# EAGLE design 6DOF-Digital-v10 (EAGLE 5.10)
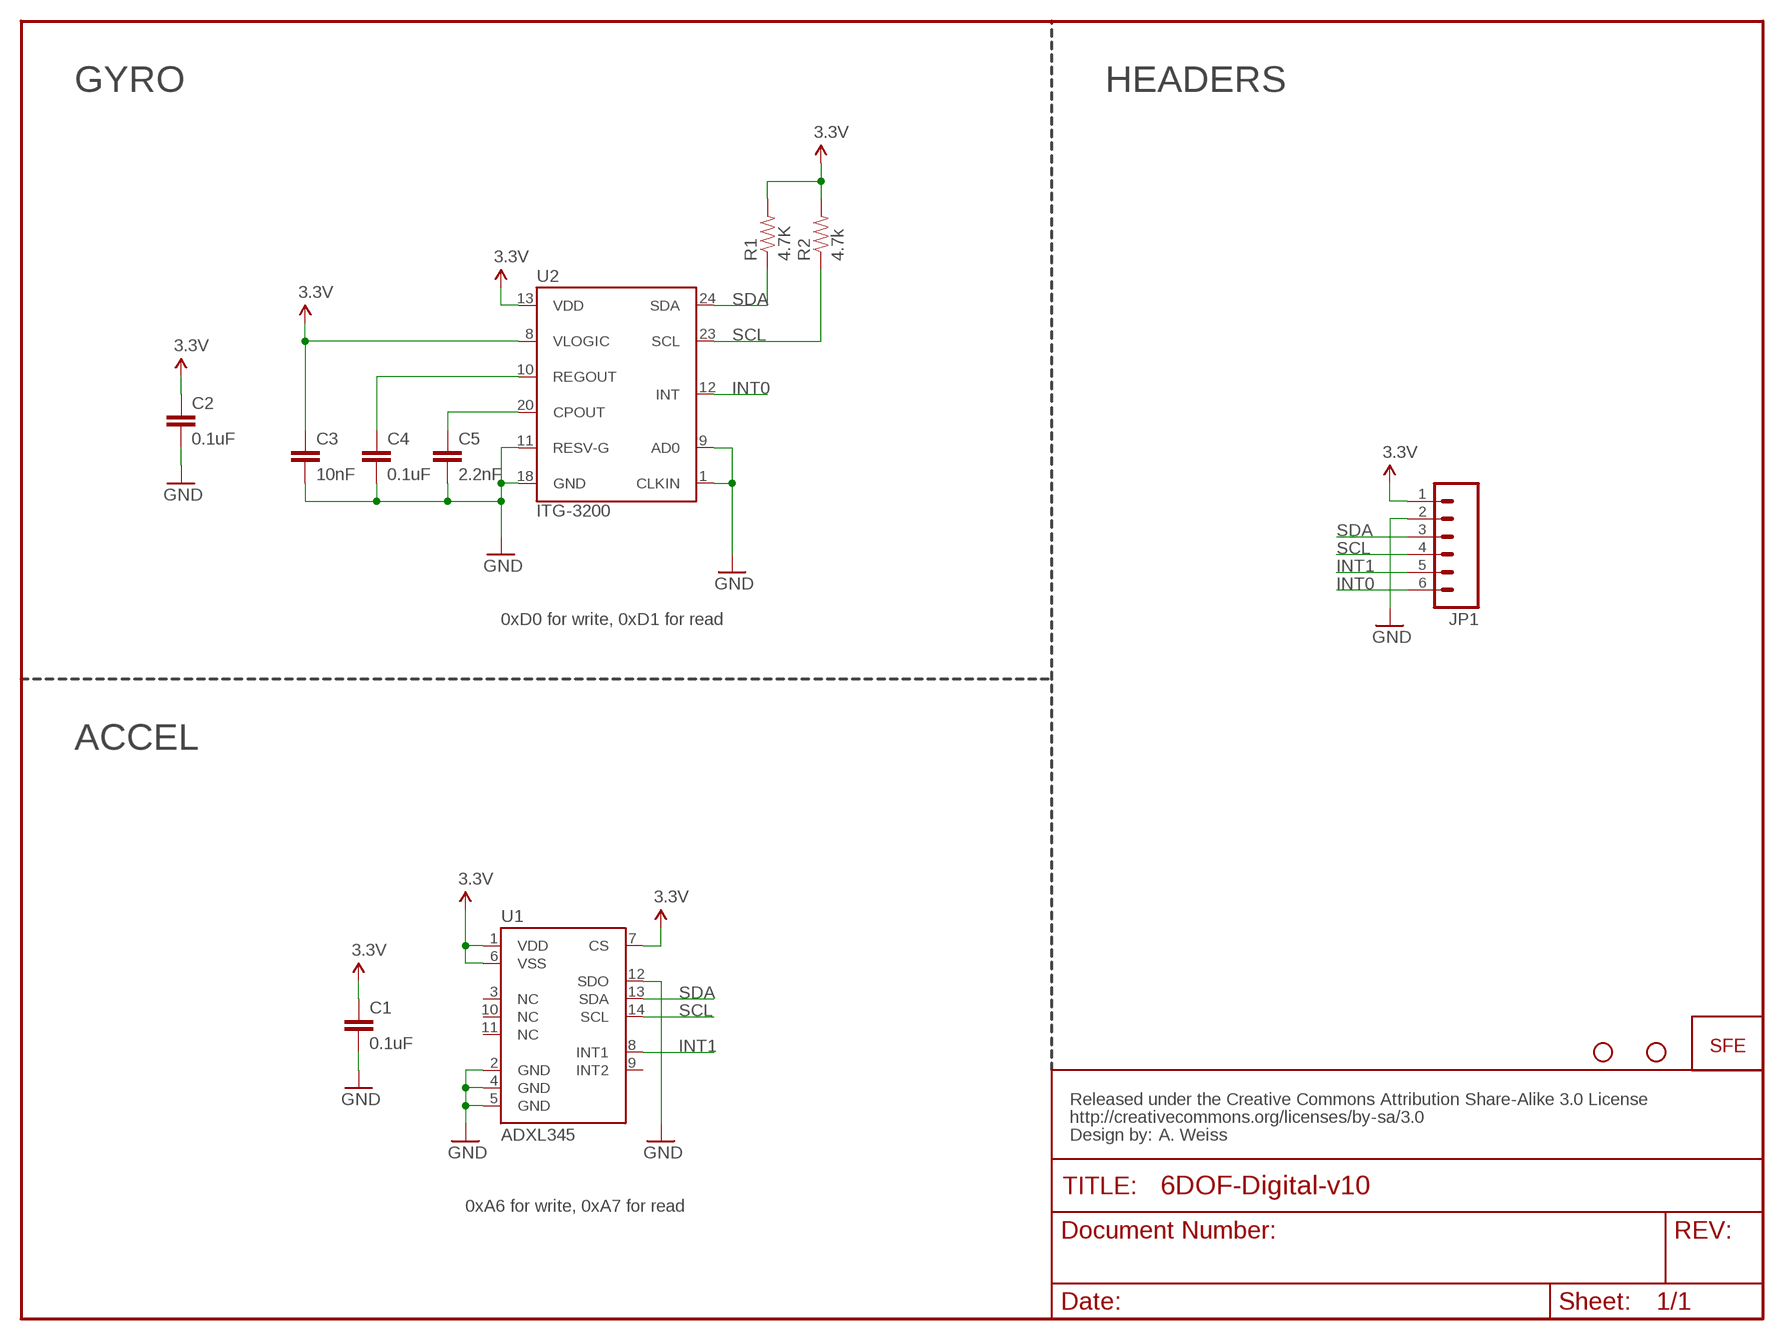
[diagram p0: schematic, sheet 1]

## Parts
C1  0.1uF  CAP0402-CAP  [0402-CAP]
C2  0.1uF  CAP0402-CAP  [0402-CAP]
C3  10nF  CAP0402-CAP  [0402-CAP]
C4  0.1uF  CAP0402-CAP  [0402-CAP]
C5  2.2nF  CAP0402-CAP  [0402-CAP]
JP1  M06SIP  [1X06]
JP2  STAND-OFF  [STAND-OFF]
JP3  LOGO-SFESK  [SFE-LOGO-FLAME]
JP5  STAND-OFF  [STAND-OFF]
R1  4.7K  RESISTOR0402-RES  [0402-RES]
R2  4.7k  RESISTOR0402-RES  [0402-RES]
U1  ADXL345  [LGA14]
U2  ITG-3200  [QFN-24]
U$1  CREATIVE_COMMONS  [CREATIVE_COMMONS]

## Nets
3.3V: C1.1 C2.1 C3.1 JP1.1 R1.2 R2.2 U1.1(VDD) U1.6(VSS) U1.7(CS) U2.8(VLOGIC) U2.13(VDD)
GND: C1.2 C2.2 C3.2 C4.2 C5.2 JP1.2 U1.2(GND) U1.4(GND) U1.5(GND) U1.12(SDO) U2.1(CLKIN) U2.9(AD0) U2.11(RESV-G) U2.18(GND)
INT0: JP1.6 U2.12(INT)
INT1: JP1.5 U1.8(INT1)
N$2: C5.1 U2.20(CPOUT)
N$3: C4.1 U2.10(REGOUT)
SCL: JP1.4 R2.1 U1.14(SCL) U2.23(SCL)
SDA: JP1.3 R1.1 U1.13(SDA) U2.24(SDA)
Unconnected: U1.3(NC) U1.9(INT2) U1.10(NC) U1.11(NC)

## Notes on the sheet
- GYRO | HEADERS
- 0xD0 for write, 0xD1 for read
- ACCEL
- A. Weiss
- 0xA6 for write, 0xA7 for read

## Library data of the parts
C1-C5 = SparkFun:CAP: Capacitor Standard 0603 ceramic capacitor, and 0.1" leaded capacitor.
JP1 = SparkFun:M06: Header 6 Standard 6-pin 0.1" header. Use with straight break away headers (SKU : PRT-00116), right angle break away headers (PRT-00553), swiss pins (PRT-00743), machine pins (PRT-00117), and female headers (PRT-00115). Molex polarized connector foot print use with SKU : PRT-08094 with associated crimp pins and housings. NOTES ON THE VARIANTS LOCK and LOCK_LONGPADS... This footprint was designed to help hold the alignment of a through-hole component (i.e. 6-pin header) while soldering it into place. You may notice that each hole has been shifted either up or down by 0.005 of an inch from it's more standard position (which is a perfectly straight line). This slight alteration caused the pins (the squares in the middle) to touch the edges of the holes. Because they are alternating, it causes a "brace" to hold the component in place. 0.005 has proven to be the perfect amount of "off-center" position when using our standard breakaway headers. Although looks a little odd when you look at the bare footprint, once you have a header in there, the alteration is very hard to notice. Also, if you push a header all the way into place, it is covered up entirely on the bottom side. This idea of altering the position of holes to aid alignment will be further integrated into the Sparkfun Library for other footprints. It can help hold any component with 3 or more connection pins.
JP2 JP5 = SparkFun:STAND-OFF: Stand Off This is the mechanical footprint for a #4 phillips button head screw. Use the keepout ring to avoid running the screw head into surrounding components. SKU : PRT-00447
JP3 = SparkFun:LOGO-SFE: Spark Fun Electronics PCB Logo This is the standard Spark Fun Electronics PCB logo.
R1 R2 = SparkFun:RESISTOR: Resistor Basic schematic elements and footprints for 0603, 1206, and PTH resistors.
U1 = SparkFun:ADXL345
U2 = SparkFun:ITG-3200: ITG-3200 3-axis gyro, digital output, qfn24 package
U$1 = SparkFun:CREATIVE_COMMONS

## Board
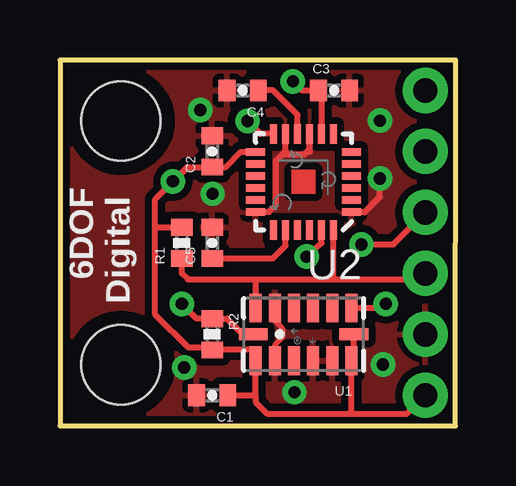
[diagram p1: board, top side]
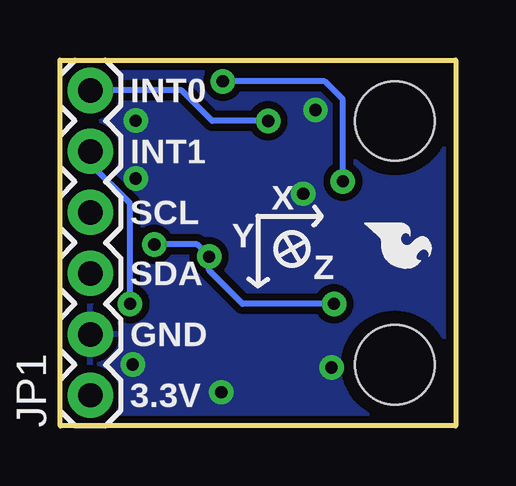
[diagram p2: board, bottom side, seen from below]

Size 16.51 x 15.24 mm. Coordinates in mm from the lower left corner, seen from the top.
Outline: 0,0 16.49,0 16.51,15.24 0,15.24 0,0
Copper layers (1*16): Top 0.035mm / dielectric 1.5mm / Bottom 0.035mm
Design rules "SparkFun": minimum track width 8mil, minimum drill 20mil, track to track 8mil, track to pad 8mil, pad to pad 8mil, via to via 8mil, smd to smd 8mil, copper to edge 8mil, drill to drill 8mil, minimum pad ring 12mil, minimum via ring 10mil, stop-mask expansion 4mil, vias tented up to drill 20mil, thermal gap 10mil

### Footprints (pad centres in the part's own frame; a part is rotated, then mirrored left to right if it is on the bottom)
0402-CAP = smd 0.7 x 0.9: 1 -0.65,0; 2 0.65,0
1X06 = drill 1.016 pad 1.88 round: 1 0,0; 2 2.54,0; 3 5.08,0; 4 7.62,0; 5 10.16,0; 6 12.7,0
STAND-OFF = hole 3.302: 0,0
0402-RES = smd 0.7 x 0.9: 1 -0.65,0; 2 0.65,0
LGA14 = smd 0.5 x 1.2: 1 2,1.1; 2 1.2,1.1; 3 0.4,1.1; 4 -0.4,1.1; 5 -1.2,1.1; 6 -2,1.1; 8 -2,-1.1; 9 -1.2,-1.1; 10 -0.4,-1.1; 11 0.4,-1.1; 12 1.2,-1.1; 13 2,-1.1 | smd 1.2 x 0.5: 7 -2.1,0; 14 2.1,0
QFN-24 = smd 0.8 x 0.3: 1 -2,1.25; 2 -2,0.75; 3 -2,0.25; 4 -2,-0.25; 5 -2,-0.75; 6 -2,-1.25; 13 2,-1.25; 14 2,-0.75; 15 2,-0.25; 16 2,0.25; 17 2,0.75; 18 2,1.25 | smd 0.3 x 0.8: 7 -1.25,-2; 8 -0.75,-2; 9 -0.25,-2; 10 0.25,-2; 11 0.75,-2; 12 1.25,-2; 19 1.25,2; 20 0.75,2; 21 0.25,2; 22 -0.25,2; 23 -0.75,2; 24 -1.25,2

### Placement (x,y rotation side)
C1  6.35,1.27 180 top
C2  6.35,11.43 90 top
C3  11.43,13.97 0 top
C4  7.62,13.97 180 top
C5  6.35,7.62 90 top
JP1  15.24,1.27 90 bottom
JP2  2.54,12.7 0 top
JP3  3.81,8.43 270 bottom
JP5  2.54,2.54 0 top
R1  5.08,7.62 90 top
R2  6.35,3.81 270 top
U1  10.16,3.81 180 top
U2  10.16,10.16 180 top
U$1  -6.35,-7.62 0 top  (outside the outline)

### Tracks (layer width: path | path; a pad name or v marks a point on that pad's centre or on a via)
3.3V  (via drill 0.51)
  Top 0.254: U1.7 12.26,2.81 U1.6 12.16,0.6 12.06,0.51 | 12.06,0.51 14.48,0.51 JP1.1 | 8.16,1.27 8.16,0.98 8.64,0.51 12.06,0.51 | 8.16,1.27 U1.1 8.16,2.99 7.99,3.16 | C1.1 8.16,1.27 | 7.99,3.16 R2.2 6.17,3.16 6.08,3.25 5.36,3.25 3.98,4.64 3.98,8.27 | 7.99,3.16 8,3.17 | 3.98,8.27 3.98,9.44 5.32,10.78 | 5.32,10.78 C2.1 6.91,10.78 7.54,11.41 U2.13 | R1.2 3.98,8.27 | U2.8 10.91,13.84 C3.1 10.1,13.97 v9.72,14.35 | 5.32,10.78 5.31,10.78 v4.71,10.19
  Bottom 0.254: v9.72,14.35 5.46,14.35 4.71,13.6 v4.71,10.19
GND  (via drill 0.51)
  Top 0.203: U1.2 8.96,3.37 9.27,3.68 9.27,4.06 8.96,4.38 U1.12
  Top 0.254: 9.27,11.3 10.2,11.3 10.41,11.52 U2.9 10.41,11.43 10.43,11.42 10.43,11.4 | 9.27,11.3 9,11.04 9,9.2 8.72,8.91 U2.18 | U2.11 9.41,11.44 9.27,11.3 | U2.1 12.68,8.91 12.7,8.89 13.35,9.54 v13.35,10.3
  other vias: 9.78,1.4 5.18,2.43 5.85,13.16 6.36,9.66 13.35,12.71 13.47,2.55
  pour Bottom (isolate 0.305): 0,15.24 0,0 16.51,0 16.51,15.24
  pour Top (isolate 0.305): 0,15.24 0,0 16.51,0 16.51,15.24
INT0  (via drill 0.51)
  Top 0.254: U2.12 8.36,12.16 v7.82,12.7
  Bottom 0.254: JP1.6 11.43,13.97 10.16,12.7 v7.82,12.7
INT1  (via drill 0.51)
  Top 0.254: U1.8 13.42,4.91 v13.59,5.08
  Bottom 0.254: v13.59,5.08 13.59,9.27 15.24,10.92 JP1.5
N$2
  Top 0.254: U2.20 9.41,7.5 8.88,6.97 C5.1
N$3
  Top 0.254: U2.10 9.91,12.95 8.89,13.97 C4.1
SCL  (via drill 0.51)
  Top 0.254: U1.14 7.62,3.81 6.97,4.46 R2.1 5.7,4.46 v5.08,5.08 | U2.23 10.91,7.61 v10.29,7.05 | v12.57,7.56 13.91,7.56 JP1.4
  Bottom 0.254: v12.57,7.56 10.79,7.56 v10.29,7.05 10.29,6.48 8.89,5.08 v5.08,5.08
SDA
  Top 0.254: 8.16,5.17 U1.13 | 8.16,5.17 8.13,5.21 | 8.09,6.1 11.43,6.1 | 11.43,6.1 14.99,6.1 JP1.3 | 8.16,5.17 8.16,6.03 8.09,6.1 | U2.24 11.41,6.12 11.43,6.1 | R1.1 5.08,6.35 5.33,6.1 8.09,6.1

### Text on the board
tPlace: 6DOF | Digital
bPlace: INT0 | INT1 | X | SCL | Y | Z | SDA | GND | 3.3V
tValues: A. Weiss